# Altium schematic sheet A_base2017.SchDoc
size A2
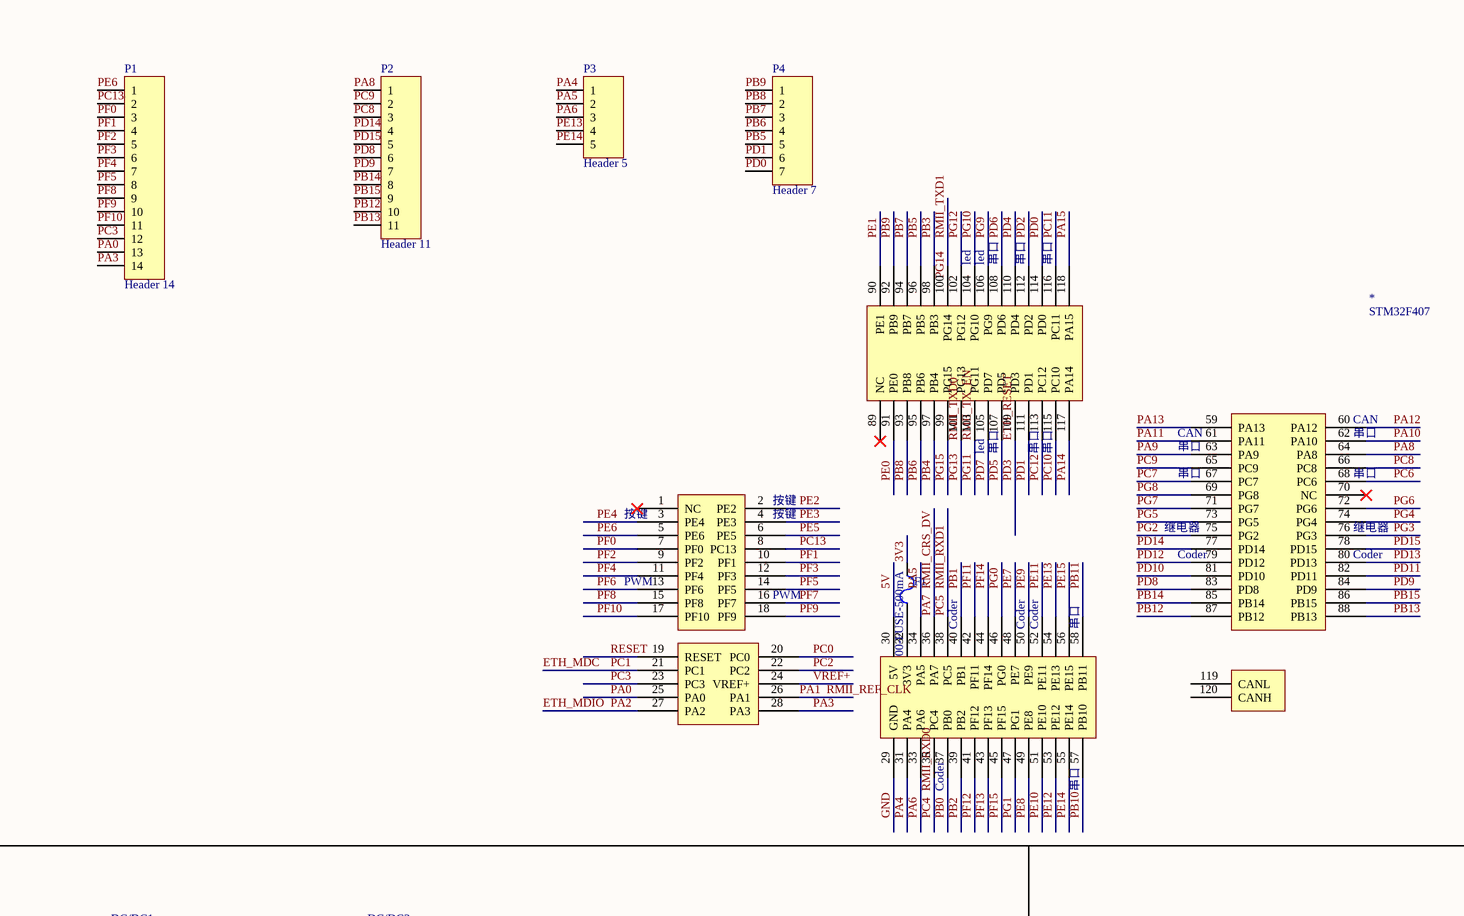
[diagram p0: A_base2017.SchDoc, top left]
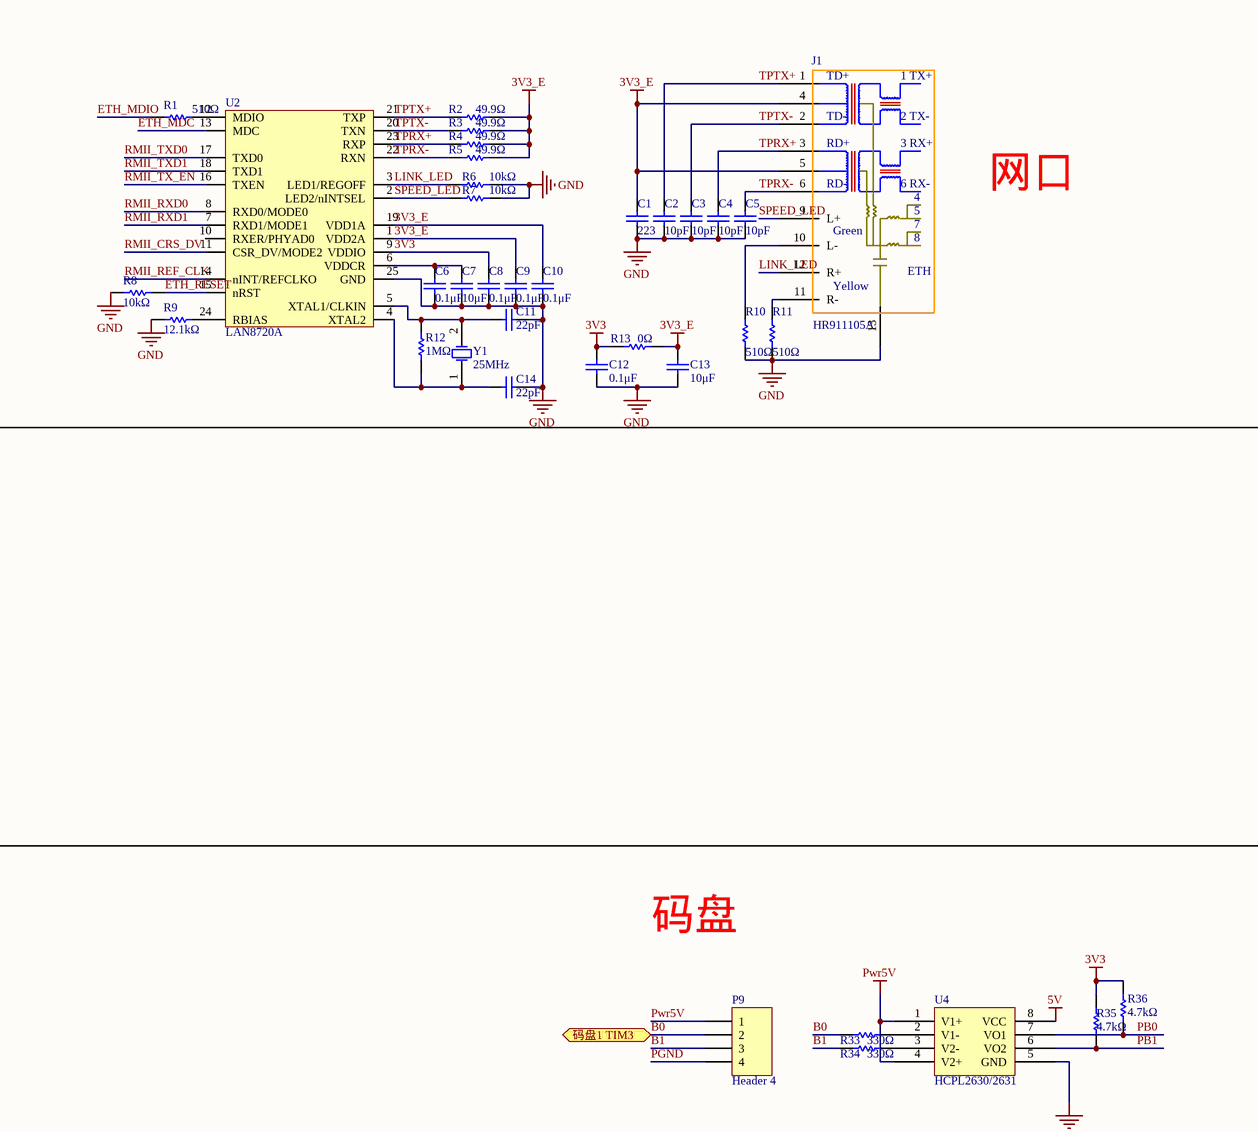
[diagram p1: A_base2017.SchDoc, top right]
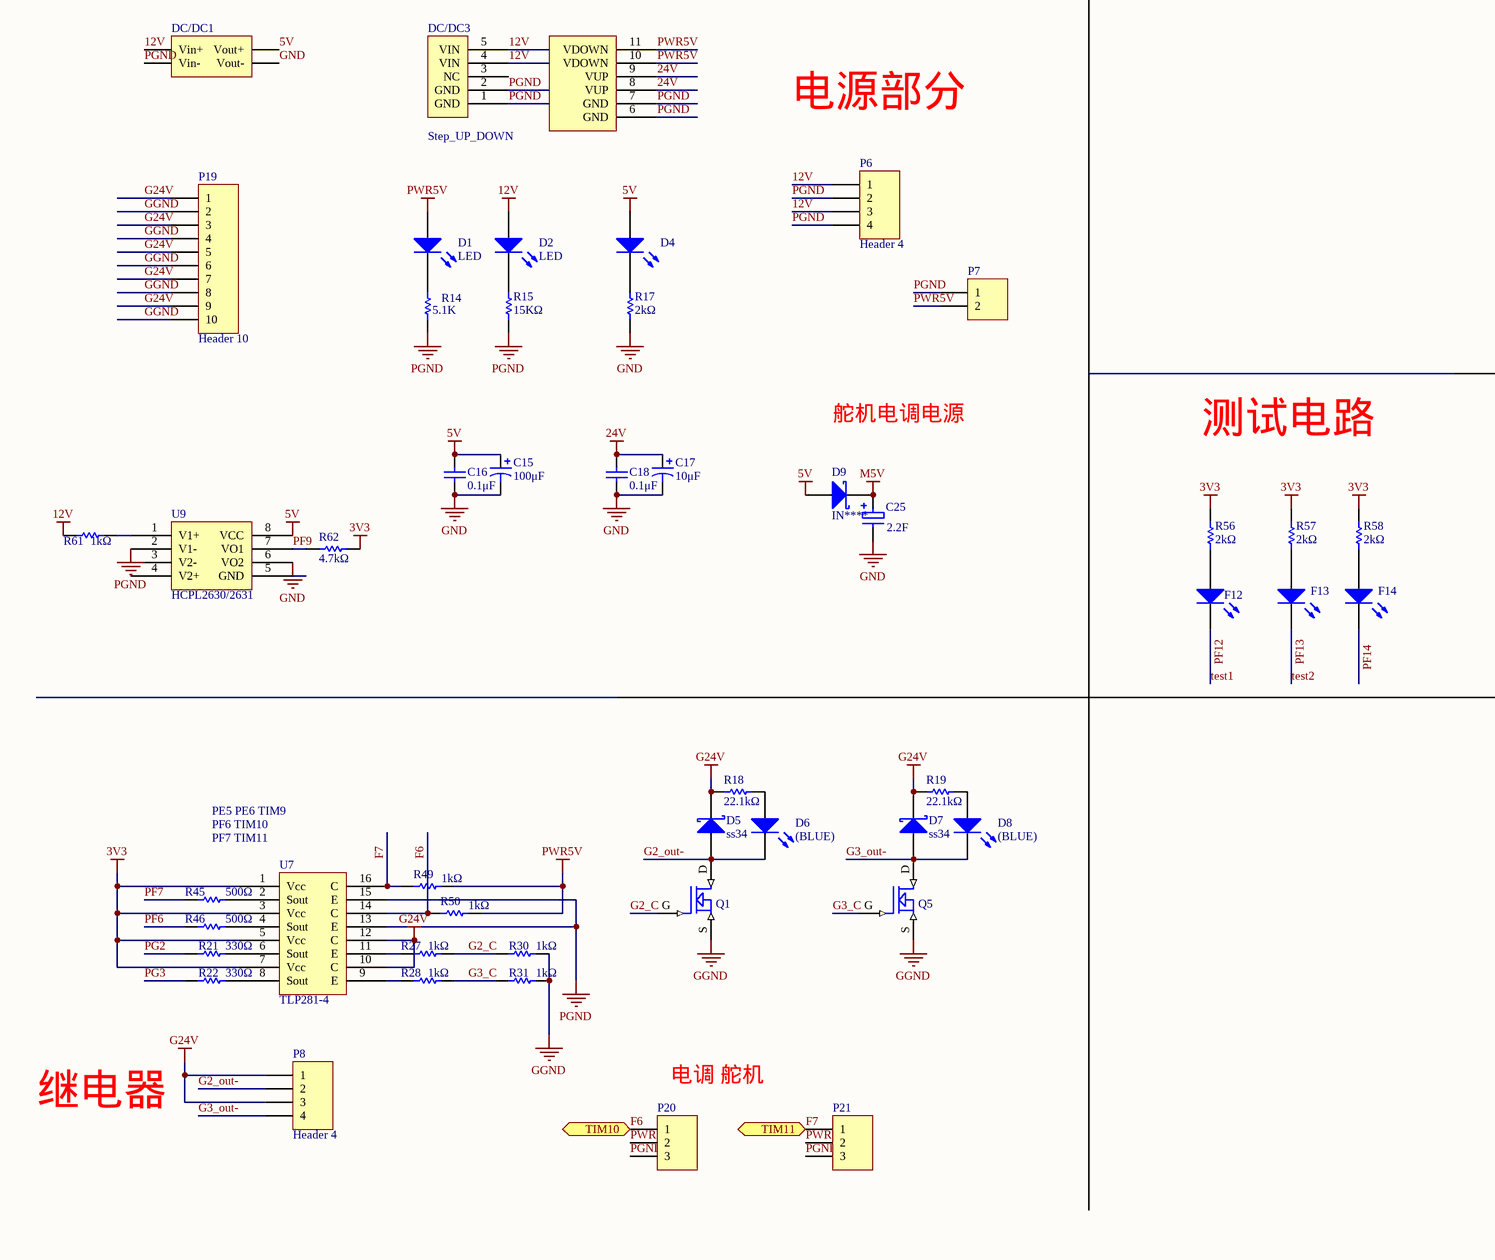
[diagram p2: A_base2017.SchDoc, bottom left]
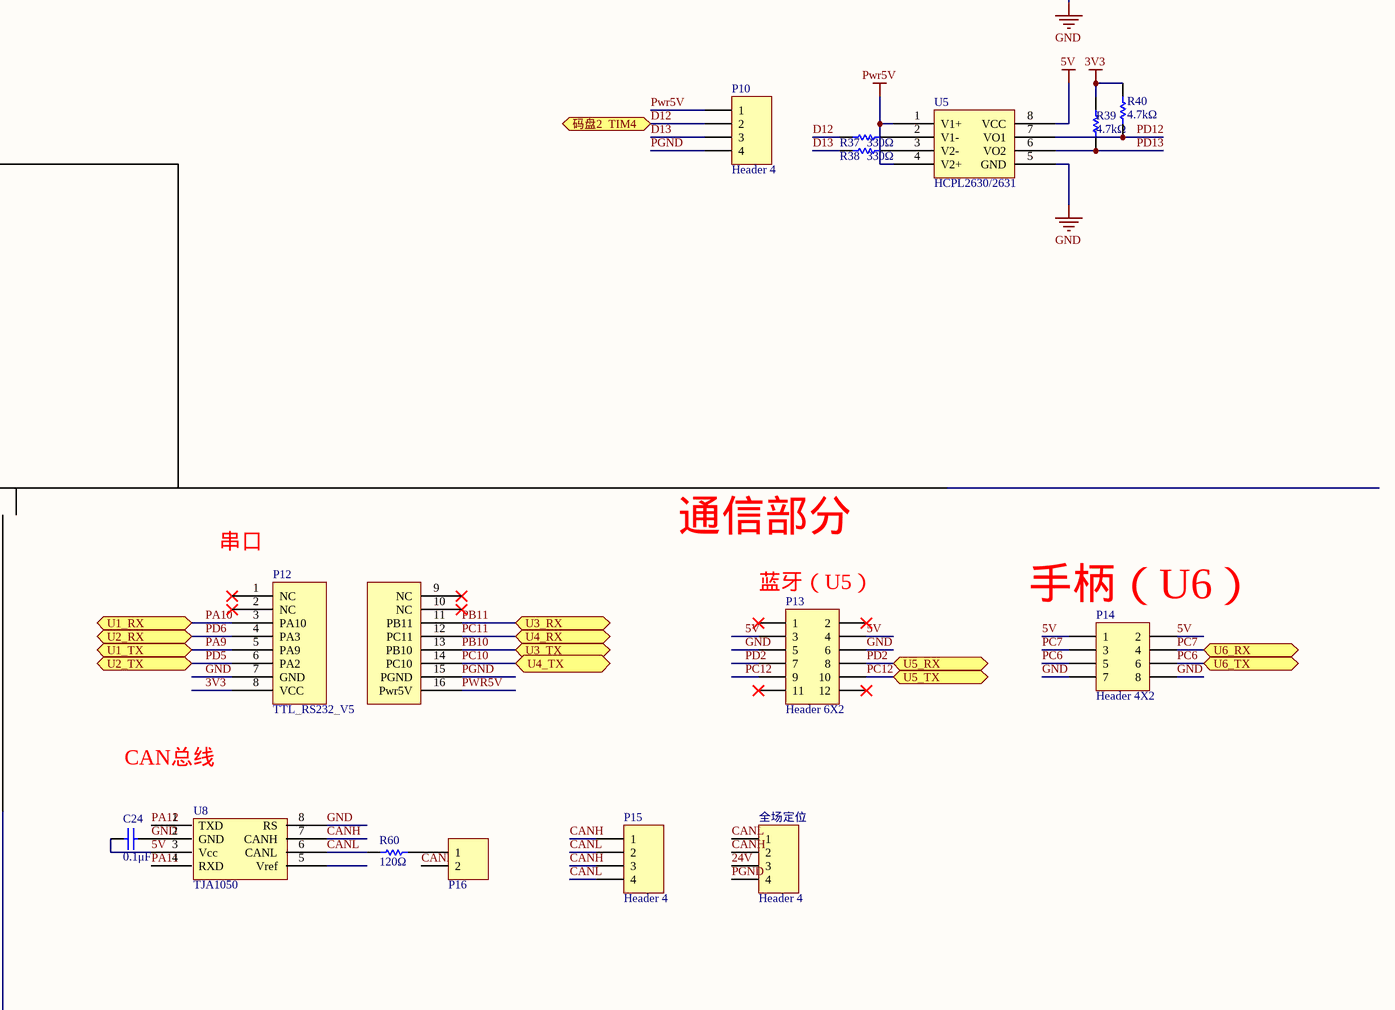
[diagram p3: A_base2017.SchDoc, bottom right]

## Parts
*  STM32F407  [STM32F407]
C1  223  [CAP-MLCC-0603]
C2  10pF  [CAP-MLCC-0603]
C3  10pF  [CAP-MLCC-0603]
C4  10pF  [CAP-MLCC-0603]
C5  10pF  [CAP-MLCC-0603]
C6  0.1μF  [CAP-MLCC-0603]
C7  10μF  [CAP-MLCC-0603]
C8  0.1μF  [CAP-MLCC-0603]
C9  0.1μF  [CAP-MLCC-0603]
C10  0.1μF  [CAP-MLCC-0603]
C11  22pF  [CAP-MLCC-0603]
C12  0.1μF  [CAP-MLCC-0603]
C13  10μF  [CAP-MLCC-0603]
C14  22pF  [CAP-MLCC-0603]
C15  value 100μF  [CAP-TAN-6032/CAPC]  (hidden comment: CAP-TAN)
C16  value 0.1μF  [CAP-MLCC-0805]  (hidden comment: CAP)
C17  value 10μF  [CAP-MLCC-0805]  (hidden comment: CAP-TAN)
C18  value 0.1μF  [CAP-MLCC-0805]  (hidden comment: CAP)
C24  0.1μF  [CAP-MLCC-0603]
C25  2.2F  [CAP-RAD0.3]
D1  LED  [LED-1206]
D2  LED  [LED-1206]
D4  LED  [LED-0805]  (value not drawn)
D5  ss34  [s4肖特基二极管]
D6  (BLUE)  [LED-0805]
D7  ss34  [s4肖特基二极管]
D8  (BLUE)  [LED-0805]
D9  IN****  [SS34A]
DC/DC1  DC/DC  [12V→5V]  (value not drawn)
DC/DC3  Step_UP_DOWN  [Step_Up_Down]
F1  00-FUSE-500mA  [0805R]
F12  LED  [LED-0805]  (value not drawn)
F13  LED  [LED-0805]  (value not drawn)
F14  LED  [LED-0805]  (value not drawn)
J1  HR911105A  [HR911105A]
P1  Header 14  [SIP14]
P2  Header 11  [SIP11]
P3  Header 5  [SIP5]
P4  Header 7  [SIP7]
P6  Header 4  [Green_4P]
P7  Header 2  [Green_2P]  (value not drawn)
P8  Header 4  [GREE_4P_ST]
P9  Header 4  [GREE_4P_ST]
P10  Header 4  [GREE_4P_ST]
P12  TTL_RS232_V5  [TTL-RS232_V5]
P13  Header 6X2  [HDR2X6]
P14  Header 4X2  [HDR2X4]
P15  Header 4  [Green_4P]
P16  Header 2  [SIP2]  (value not drawn)
P19  Header 10  [GREEN_10P]
P20  Header 3  [GREEN_3P_ST]  (value not drawn)
P21  Header 3  [GREEN_3P_ST]  (value not drawn)
Q1  MOSFET N  [LR7843]  (value not drawn)
Q5  MOSFET N  [LR7843]  (value not drawn)
R1  510Ω  [RES-0603]
R2  49.9Ω  [RES-0603]
R3  49.9Ω  [RES-0603]
R4  49.9Ω  [RES-0603]
R5  49.9Ω  [RES-0603]
R6  10kΩ  [RES-0603]
R7  10kΩ  [RES-0603]
R8  10kΩ  [RES-0603]
R9  12.1kΩ  [RES-0603]
R10  510Ω  [RES-0603]
R11  510Ω  [RES-0603]
R12  1MΩ  [RES-0603]
R13  0Ω  [RES-0603]
R14  5.1K  [RES-0603]
R15  15KΩ  [RES-0603]
R17  value 2kΩ  [RES-0603]  (hidden comment: RES)
R18  22.1kΩ  [RES-0603]
R19  22.1kΩ  [RES-0603]
R21  330Ω  [RES-0603]
R22  330Ω  [RES-0603]
R27  1kΩ  [RES-0603]
R28  1kΩ  [RES-0603]
R30  1kΩ  [RES-0603]
R31  1kΩ  [RES-0603]
R33  330Ω  [RES-0603]
R34  330Ω  [RES-0603]
R35  4.7kΩ  [RES-0603]
R36  4.7kΩ  [RES-0603]
R37  330Ω  [RES-0603]
R38  330Ω  [RES-0603]
R39  4.7kΩ  [RES-0603]
R40  4.7kΩ  [RES-0603]
R45  value 500Ω  [RES-0603]  (hidden comment: RES)
R46  value 500Ω  [RES-0603]  (hidden comment: RES)
R49  value 1kΩ  [RES-0603]  (hidden comment: RES)
R50  value 1kΩ  [RES-0603]  (hidden comment: RES)
R56  value 2kΩ  [RES-0603]  (hidden comment: RES)
R57  value 2kΩ  [RES-0603]  (hidden comment: RES)
R58  value 2kΩ  [RES-0603]  (hidden comment: RES)
R60  120Ω  [RES-0603]
R61  1kΩ  [RES-0603]
R62  4.7kΩ  [RES-0603]
U2  LAN8720A  [QFN24]
U4  HCPL2630/2631  [SOP8]
U5  HCPL2630/2631  [SOP8]
U7  TLP281-4  [SOIC16]
U8  TJA1050  [TJA1050]
U9  HCPL2630/2631  [SOP8]
Y1  25MHz  [Osc-6032]
全场定位  Header 4  [2510_4P]

## Ports
TIM10, TIM11, U1_RX, U1_TX, U2_RX, U2_TX, U3_RX, U3_TX, U4_RX, U4_TX, U5_RX, U5_TX, U6_RX, U6_TX, 码盘1 TIM3, 码盘2  TIM4

## Nets
3V3: C8.2 C12.2 F1.2 P12.8(VCC) R13.1 R35.2 R36.2 R39.2 R40.2 R56.2 R57.2 R58.2 R62.1 U2.9(VDDIO) U7.1(Vcc) U7.3(Vcc) U7.5(Vcc) U7.7(Vcc)
3V3_E: C1.2 C9.2 C10.2 C13.2 J1.4 J1.5 R2.2 R3.2 R4.2 R5.2 R13.2 U2.1(VDD2A) U2.19(VDD1A)
5V: *.30(5V) C15.1 C16.2 C24.1 D4.1(A) D9.A DC/DC1.Vout+ P13.3 P13.4 P14.1 P14.2 U4.8(VCC) U5.8(VCC) U8.3(Vcc) U9.8(VCC)
12V: D2.1(A) DC/DC1.Vin+ DC/DC3.4(VIN) DC/DC3.5(VIN) P6.1 P6.3 R61.1
24V: C17.1 C18.2 DC/DC3.8(VUP) DC/DC3.9(VUP) 全场定位.3
G24V: D5.K D7.K P8.1 P8.3 P19.1 P19.3 P19.5 P19.7 P19.9 R18.2 R19.1 U7.10(C) U7.12(C)
GGND: P19.2 P19.4 P19.6 P19.8 P19.10 Q1.S Q5.S R30.1 R31.1
GND: *.29(GND) C1.1 C2.1 C3.1 C4.1 C5.1 C6.1 C7.1 C8.1 C9.1 C10.1 C11.2 C12.1 C13.1 C14.2 C15.2 C16.1 C17.2 C18.1 C24.2 C25.2 DC/DC1.Vout- J1.13 P12.7(GND) P13.5 P13.6 P14.7 P14.8 R6.2 R7.2 R8.2 R9.2 R10.1 R11.1 R17.2 U2.25(GND) U4.5(GND) U5.5(GND) U8.2(GND) U8.8(RS) U9.6(VO2)
M5V: C25.1 D9.K
PGND: DC/DC1.Vin- DC/DC3.1(GND) DC/DC3.2(GND) DC/DC3.6(GND) DC/DC3.7(GND) P6.2 P6.4 P7.1 P9.4 P10.4 P12.15(PGND) P20.3 P21.3 R14.1 R15.1 U7.13(E) U7.15(E) U9.2(V1-) 全场定位.4
PWR5V: D1.1(A) DC/DC3.10(VDOWN) DC/DC3.11(VDOWN) P7.2 P9.1 P10.1 P12.16(Pwr5V) P20.2 P21.2 R49.2 R50.2 U4.1(V1+) U4.4(V2+) U5.1(V1+) U5.4(V2+)
B0: P9.2 R33.1 ; port 码盘1 TIM3
B1: P9.3 R34.1
CANH: P15.1 P15.3 P16.2 U8.7(CANH) 全场定位.2
CANL: P15.2 P15.4 R60.1 U8.6(CANL) 全场定位.1
D12: P10.2 R37.1 ; port 码盘2  TIM4
D13: P10.3 R38.1
ETH_MDC: *.21(PC1) U2.13(MDC)  [also labelled PC1]
ETH_MDIO: *.27(PA2) R1.1  [also labelled PA2]
ETH_RESET: *.109(PD3) R8.1 U2.15(nRST)  [also labelled PD3]
F6: P20.1 R50.1 U7.14(C) ; port TIM10
F7: P21.1 R49.1 U7.16(C) ; port TIM11
G2_C: Q1.G R27.2 R30.2
G2_out-: D5.A D6.2(K) P8.2 Q1.D
G3_C: Q5.G R28.2 R31.2
G3_out-: D7.A D8.2(K) P8.4 Q5.D
LINK_LED: J1.12(R+) R6.1 U2.3(LED1/REGOFF)
PA0: *.25(PA0) P1.13
PA1: *.26(PA1) U2.14(nINT/REFCLKO)  [also labelled RMII_REF_CLK]
PA3: *.28(PA3) P1.14
PA4: *.31(PA4) P3.1
PA5: *.34(PA5) P3.2
PA6: *.33(PA6) P3.3
PA7: *.36(PA7) U2.11(CSR_DV/MODE2)  [also labelled RMII_CRS_DV]
PA8: *.64(PA8) P2.1
PA9: *.63(PA9) P12.5(PA9) ; port U1_TX
PA10: *.62(PA10) P12.3(PA10) ; port U1_RX
PA11: *.61(PA11) U8.4(RXD)
PA12: *.60(PA12) U8.1(TXD)
PA13: *.59(PA13)
PA14: *.117(PA14)
PA15: *.118(PA15)
PB0: *.37(PB0) R36.1 U4.7(VO1)
PB1: *.40(PB1) R35.1 U4.6(VO2)
PB2: *.39(PB2)
PB3: *.98(PB3)
PB4: *.97(PB4)
PB5: *.96(PB5) P4.5
PB6: *.95(PB6) P4.4
PB7: *.94(PB7) P4.3
PB8: *.93(PB8) P4.2
PB9: *.92(PB9) P4.1
PB10: *.57(PB10) P12.13(PB10) ; port U3_TX
PB11: *.58(PB11) P12.11(PB11) ; port U3_RX
PB12: *.87(PB12) P2.10
PB13: *.88(PB13) P2.11
PB14: *.85(PB14) P2.8
PB15: *.86(PB15) P2.9
PC0: *.20(PC0)
PC2: *.22(PC2)
PC3: *.23(PC3) P1.12
PC4: *.35(PC4) U2.8(RXD0/MODE0)  [also labelled RMII_RXD0]
PC5: *.38(PC5) U2.7(RXD1/MODE1)  [also labelled RMII_RXD1]
PC6: *.68(PC6) P14.5 P14.6 ; port U6_TX
PC7: *.67(PC7) P14.3 P14.4 ; port U6_RX
PC8: *.66(PC8) P2.3
PC9: *.65(PC9) P2.2
PC10: *.115(PC10) P12.14(PC10) ; port U4_TX
PC11: *.116(PC11) P12.12(PC11) ; port U4_RX
PC12: *.113(PC12) P13.9 P13.10 ; port U5_TX
PC13: *.8(PC13) P1.2
PD0: *.114(PD0) P4.7
PD1: *.111(PD1) P4.6
PD2: *.112(PD2) P13.7 P13.8 ; port U5_RX
PD4: *.110(PD4)
PD5: *.107(PD5) P12.6(PA2) ; port U2_TX
PD6: *.108(PD6) P12.4(PA3) ; port U2_RX
PD7: *.105(PD7)
PD8: *.83(PD8) P2.6
PD9: *.84(PD9) P2.7
PD10: *.81(PD10)
PD11: *.82(PD11)
PD12: *.79(PD12) R40.1 U5.7(VO1)
PD13: *.80(PD13) R39.1 U5.6(VO2)
PD14: *.77(PD14) P2.4
PD15: *.78(PD15) P2.5
PE0: *.91(PE0)
PE1: *.90(PE1)
PE2: *.2(PE2)
PE3: *.4(PE3)
PE4: *.3(PE4)
PE5: *.6(PE5)
PE6: *.5(PE6) P1.1
PE7: *.48(PE7)
PE8: *.49(PE8)
PE9: *.50(PE9)
PE10: *.51(PE10)
PE11: *.52(PE11)
PE12: *.53(PE12)
PE13: *.54(PE13) P3.4
PE14: *.55(PE14) P3.5
PE15: *.56(PE15)
PF0: *.7(PF0) P1.3
PF1: *.10(PF1) P1.4
PF2: *.9(PF2) P1.5
PF3: *.12(PF3) P1.6
PF4: *.11(PF4) P1.7
PF5: *.14(PF5) P1.8
PF6: *.13(PF6) R46.1
PF7: *.16(PF7) R45.1
PF8: *.15(PF8) P1.9
PF9: *.18(PF9) P1.10 R62.2 U9.7(VO1)
PF10: *.17(PF10) P1.11
PF11: *.42(PF11)
PF12: *.41(PF12) F12.2(K)  [also labelled test1]
PF13: *.43(PF13) F13.2(K)  [also labelled test2]
PF14: *.44(PF14) F14.2(K)
PF15: *.45(PF15)
PG0: *.46(PG0)
PG1: *.47(PG1)
PG2: *.75(PG2) R21.1
PG3: *.76(PG3) R22.1
PG4: *.74(PG4)
PG5: *.73(PG5)
PG6: *.72(PG6)
PG7: *.71(PG7)
PG8: *.69(PG8)
PG9: *.106(PG9)
PG10: *.104(PG10)
PG11: *.103(PG11) U2.16(TXEN)  [also labelled RMII_TX_EN]
PG12: *.102(PG12)
PG13: *.101(PG13) U2.17(TXD0)  [also labelled RMII_TXD0]
PG15: *.99(PG15)
RESET: *.19(RESET)
RMII_TXD1: *.100(PG14) U2.18(TXD1)
SPEED_LED: J1.9(L+) R7.1 U2.2(LED2/nINTSEL)
TPRX+: C4.2 J1.3 R4.1 U2.23(RXP)
TPRX-: C5.2 J1.6 R5.1 U2.22(RXN)
TPTX+: C2.2 J1.1 R2.1 U2.21(TXP)
TPTX-: C3.2 J1.2 R3.1 U2.20(TXN)
VREF+: *.24(VREF+)
Net*_32: *.32(3V3) F1.1
NetC6_2: C6.2 C7.2 U2.6(VDDCR)
NetC11_1: C11.1 R12.2 U2.5(XTAL1/CLKIN) Y1.2(OSC2)
NetC14_1: C14.1 R12.1 U2.4(XTAL2) Y1.1(OSC1)
NetD1_2: D1.2(K) R14.2
NetD2_2: D2.2(K) R15.2
NetD4_2: D4.2(K) R17.1
NetD6_1: D6.1(A) R18.1
NetD8_1: D8.1(A) R19.2
NetF12_1: F12.1(A) R56.1
NetF13_1: F13.1(A) R57.1
NetF14_1: F14.1(A) R58.1
NetJ1_10: J1.10(L-) R10.2
NetJ1_11: J1.11(R-) R11.2
NetP16_1: P16.1 R60.2
NetR1_2: R1.2 U2.12(MDIO)
NetR9_1: R9.1 U2.24(RBIAS)
NetR21_2: R21.2 U7.6(Sout)
NetR22_2: R22.2 U7.8(Sout)
NetR27_1: R27.1 U7.11(E)
NetR28_1: R28.1 U7.9(E)
NetR33_2: R33.2 U4.2(V1-)
NetR34_2: R34.2 U4.3(V2-)
NetR37_2: R37.2 U5.2(V1-)
NetR38_2: R38.2 U5.3(V2-)
NetR45_2: R45.2 U7.2(Sout)
NetR46_2: R46.2 U7.4(Sout)
NetR61_2: R61.2 U9.1(V1+)

Not connected (* = marked no-connect by the designer): * 1(NC)* 70(NC)* 89(NC)* 119(CANL) 120(CANH); DC/DC3 3(NC); P12 1(NC)* 2(NC)* 9(NC)* 10(NC)*; P13 1* 2* 11* 12*; U2 10(RXER/PHYAD0); U8 5(Vref); U9 3(V2-) 4(V2+) 5(GND)

## Notes on the sheet
- 网口
- (near *) led
- (near *) 串口
- (near *) CAN
- (near *) 按键
- (near *) 继电器
- (near *) PWM
- (near *) Coder
- 码盘
- 电源部分
- 舵机电调电源
- 测试电路
- (near P12) 串口
- 通信部分
- PE5 PE6 TIM9
- PF6 TIM10
- PF7 TIM11
- (near P13) 蓝牙（U5）
- (near P14) 手柄（U6）
- CAN总线
- 继电器
- (near P20) 电调 舵机
- Labels drawn without touching a wire or pin: PG14
- (in symbol HR911105A) TD+; 1 TX+; TD-; 2 TX-; RD+; 3 RX+; RD-; 6 RX-; 7; Green; 8; ETH; Yellow

## Library data of the parts
C1-C14 C24 = CAP: Value: *μF; Published: 8-Jun-2000; LatestRevisionDate: 17-Jul-2002; LatestRevisionNote: Re-released for DXP Platform.; PackageReference: RAD-0.3; Publisher: Altium Limited; PackageDescription: Radial Cap, Thru-Hole; 2 Leads; 0.3 in Pin Spacing
C25 = CAP-ELE: 电解电容; Value: *μF; Published: 8-Jun-2000; LatestRevisionDate: 17-Jul-2002; LatestRevisionNote: Re-released for DXP Platform.; PackageReference: RB7.6-15; Publisher: Altium Limited; PackageDescription: Polarized Capacitor (Radial); 2 Leads
D1 D2 D4 D6 D8 F12-F14 = LED: Value: (Red); Published: 8-Jun-2000; LatestRevisionDate: 08-Jul-2005; LatestRevisionNote: Mech Layer 1 removed.; PackageReference: LED-1; Publisher: Altium Limited; PackageDescription: LED; 2 Leads
D5 D7 D9 = DIODE-Schottky: 肖特基二极管; Value: 1N****; Published: 8-Jun-2000; LatestRevisionDate: 17-Jul-2002; LatestRevisionNote: Re-released for DXP Platform.; PackageReference: SMB; Publisher: Altium Limited; PackageDescription: DO-214-AA/SMB; 2 C-Bend Leads; Body 5.3 x 3.6 mm, inc. leads (LxW); Code_JEDEC: DO-214-AA
DC/DC1 = DC/DC: 12转5; LatestRevisionDate: 17-Jul-2002; LatestRevisionNote: Re-released for DXP Platform.; Publisher: Altium Limited
DC/DC3 = Step_DOWN
F1 = 00-FUSE: FUSE
P1 = Header 14: Header, 14-Pin; LatestRevisionDate: 17-Jul-2002; LatestRevisionNote: Re-released for DXP Platform.; Publisher: Altium Limited
P2 = Header 11: Header, 11-Pin; LatestRevisionDate: 17-Jul-2002; LatestRevisionNote: Re-released for DXP Platform.; Publisher: Altium Limited
P3 = Header 5: Header, 5-Pin; LatestRevisionDate: 17-Jul-2002; LatestRevisionNote: Re-released for DXP Platform.; Publisher: Altium Limited
P4 = Header 7: Header, 7-Pin; LatestRevisionDate: 17-Jul-2002; LatestRevisionNote: Re-released for DXP Platform.; Publisher: Altium Limited
P6 P8-P10 P15 全场定位 = Header 4: Header, 4-Pin; LatestRevisionDate: 17-Jul-2002; LatestRevisionNote: Re-released for DXP Platform.; Publisher: Altium Limited
P7 P16 = Header 2: Header, 2-Pin; LatestRevisionDate: 17-Jul-2002; LatestRevisionNote: Re-released for DXP Platform.; Publisher: Altium Limited
P13 = Header 6X2: Header, 6-Pin, Dual row; LatestRevisionDate: 17-Jul-2002; LatestRevisionNote: Re-released for DXP Platform.; Publisher: Altium Limited
P14 = Header 4X2: Header, 4-Pin, Dual row; LatestRevisionDate: 17-Jul-2002; LatestRevisionNote: Re-released for DXP Platform.; Publisher: Altium Limited
P19 = Header 10: Header, 10-Pin; LatestRevisionDate: 17-Jul-2002; LatestRevisionNote: Re-released for DXP Platform.; Publisher: Altium Limited
P20 P21 = Header 3: Header, 3-Pin; LatestRevisionDate: 17-Jul-2002; LatestRevisionNote: Re-released for DXP Platform.; Publisher: Altium Limited
Q1 Q5 = MOSFET N: IRF530
R1-R15 R18 R19 R21 R22 R27 R28 R30 R31 R33-R40 R60-R62 = RES: 电阻; Value: *kΩ; Published: 8-Jun-2000; LatestRevisionDate: 17-Jul-2002; LatestRevisionNote: Re-released for DXP Platform.; PackageReference: AXIAL-0.3; Publisher: Altium Limited; PackageDescription: Axial Device, Thru-Hole; 2 Leads; 0.3 in Pin Spacing
R17 R45 R46 R49 R50 R56-R58 = RES: 电阻; Published: 8-Jun-2000; LatestRevisionDate: 17-Jul-2002; LatestRevisionNote: Re-released for DXP Platform.; PackageReference: AXIAL-0.3; Publisher: Altium Limited; PackageDescription: Axial Device, Thru-Hole; 2 Leads; 0.3 in Pin Spacing
U2 = LAN8720: ETH PHY
U7 = IC-TLP521-4: TLP521-4,TLP281-4
U8 = TJA1050: CAN总线收发器
Y1 = C-Osc: Crystal Oscillator; Published: 8-Jun-2000; LatestRevisionDate: 17-Jul-2002; LatestRevisionNote: Re-released for DXP Platform.; PackageReference: R38; Publisher: Altium Limited; PackageDescription: Crystal, Thru-Hole; 2 Leads; Body 3.1 x 8.2 mm (Dia.xH)
C15 C17 = CAP-TAN: Published: 8-Jun-2000; LatestRevisionDate: 17-Jul-2002; LatestRevisionNote: Re-released for DXP Platform.; PackageReference: POLAR0.8; Publisher: Altium Limited; PackageDescription: Polarized Capacitor; 2 Leads
C16 C18 = CAP: Published: 8-Jun-2000; LatestRevisionDate: 17-Jul-2002; LatestRevisionNote: Re-released for DXP Platform.; PackageReference: RAD-0.3; Publisher: Altium Limited; PackageDescription: Radial Cap, Thru-Hole; 2 Leads; 0.3 in Pin Spacing